# Altium schematic sheet DATN2022.Display.SchDoc
size A
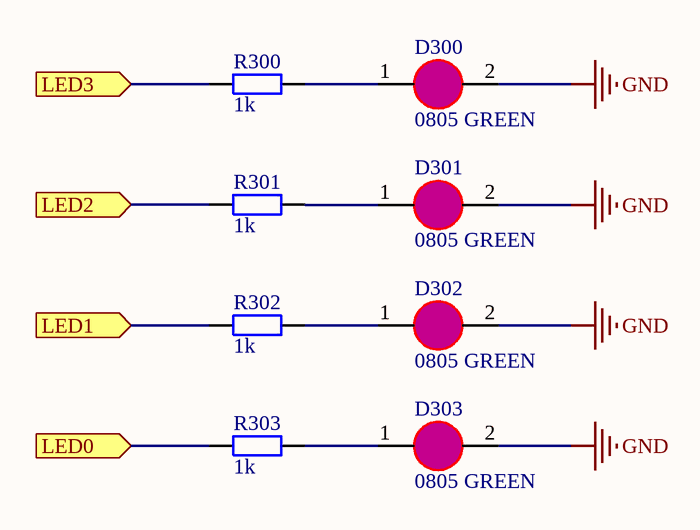
[diagram p0: DATN2022.Display.SchDoc]

## Parts
D300  0805 GREEN  [LED_0805_GREEN]
D301  0805 GREEN  [LED_0805_GREEN]
D302  0805 GREEN  [LED_0805_GREEN]
D303  0805 GREEN  [LED_0805_GREEN]
R300  1k  [RES_0805(2012)]
R301  1k  [RES_0805(2012)]
R302  1k  [RES_0805(2012)]
R303  1k  [RES_0805(2012)]

## Ports
LED0 (in), LED1 (in), LED2 (in), LED3 (in)

## Nets
GND: D300.2(K) D301.2(K) D302.2(K) D303.2(K)
LED0: R303.1 ; port LED0
LED1: R302.1 ; port LED1
LED2: R301.1 ; port LED2
LED3: R300.1 ; port LED3
NetD300_1: D300.1(A) R300.2
NetD301_1: D301.1(A) R301.2
NetD302_1: D302.1(A) R302.2
NetD303_1: D303.1(A) R303.2

## Library data of the parts
D300-D303 = LED0805: LED SMD 0805
R300-R303 = R0805: Resistor SMD 0805; Value: 0805; Published: 8-Jun-2000; LatestRevisionDate: 17-Jul-2002; LatestRevisionNote: Re-released for DXP Platform.; PackageReference: AXIAL-0.4; Publisher: Altium Limited